# Altium schematic sheet Coolant_Relays.SchDoc: STM32F446 CNC
size B; Author: AM; CompanyName: Expatria Technologies; DrawnBy: A.Marles; Engineer: AM; Organization: Expatria Technolgoies; DocumentNumber: 7; SheetNumber: 7; SheetTotal: 22
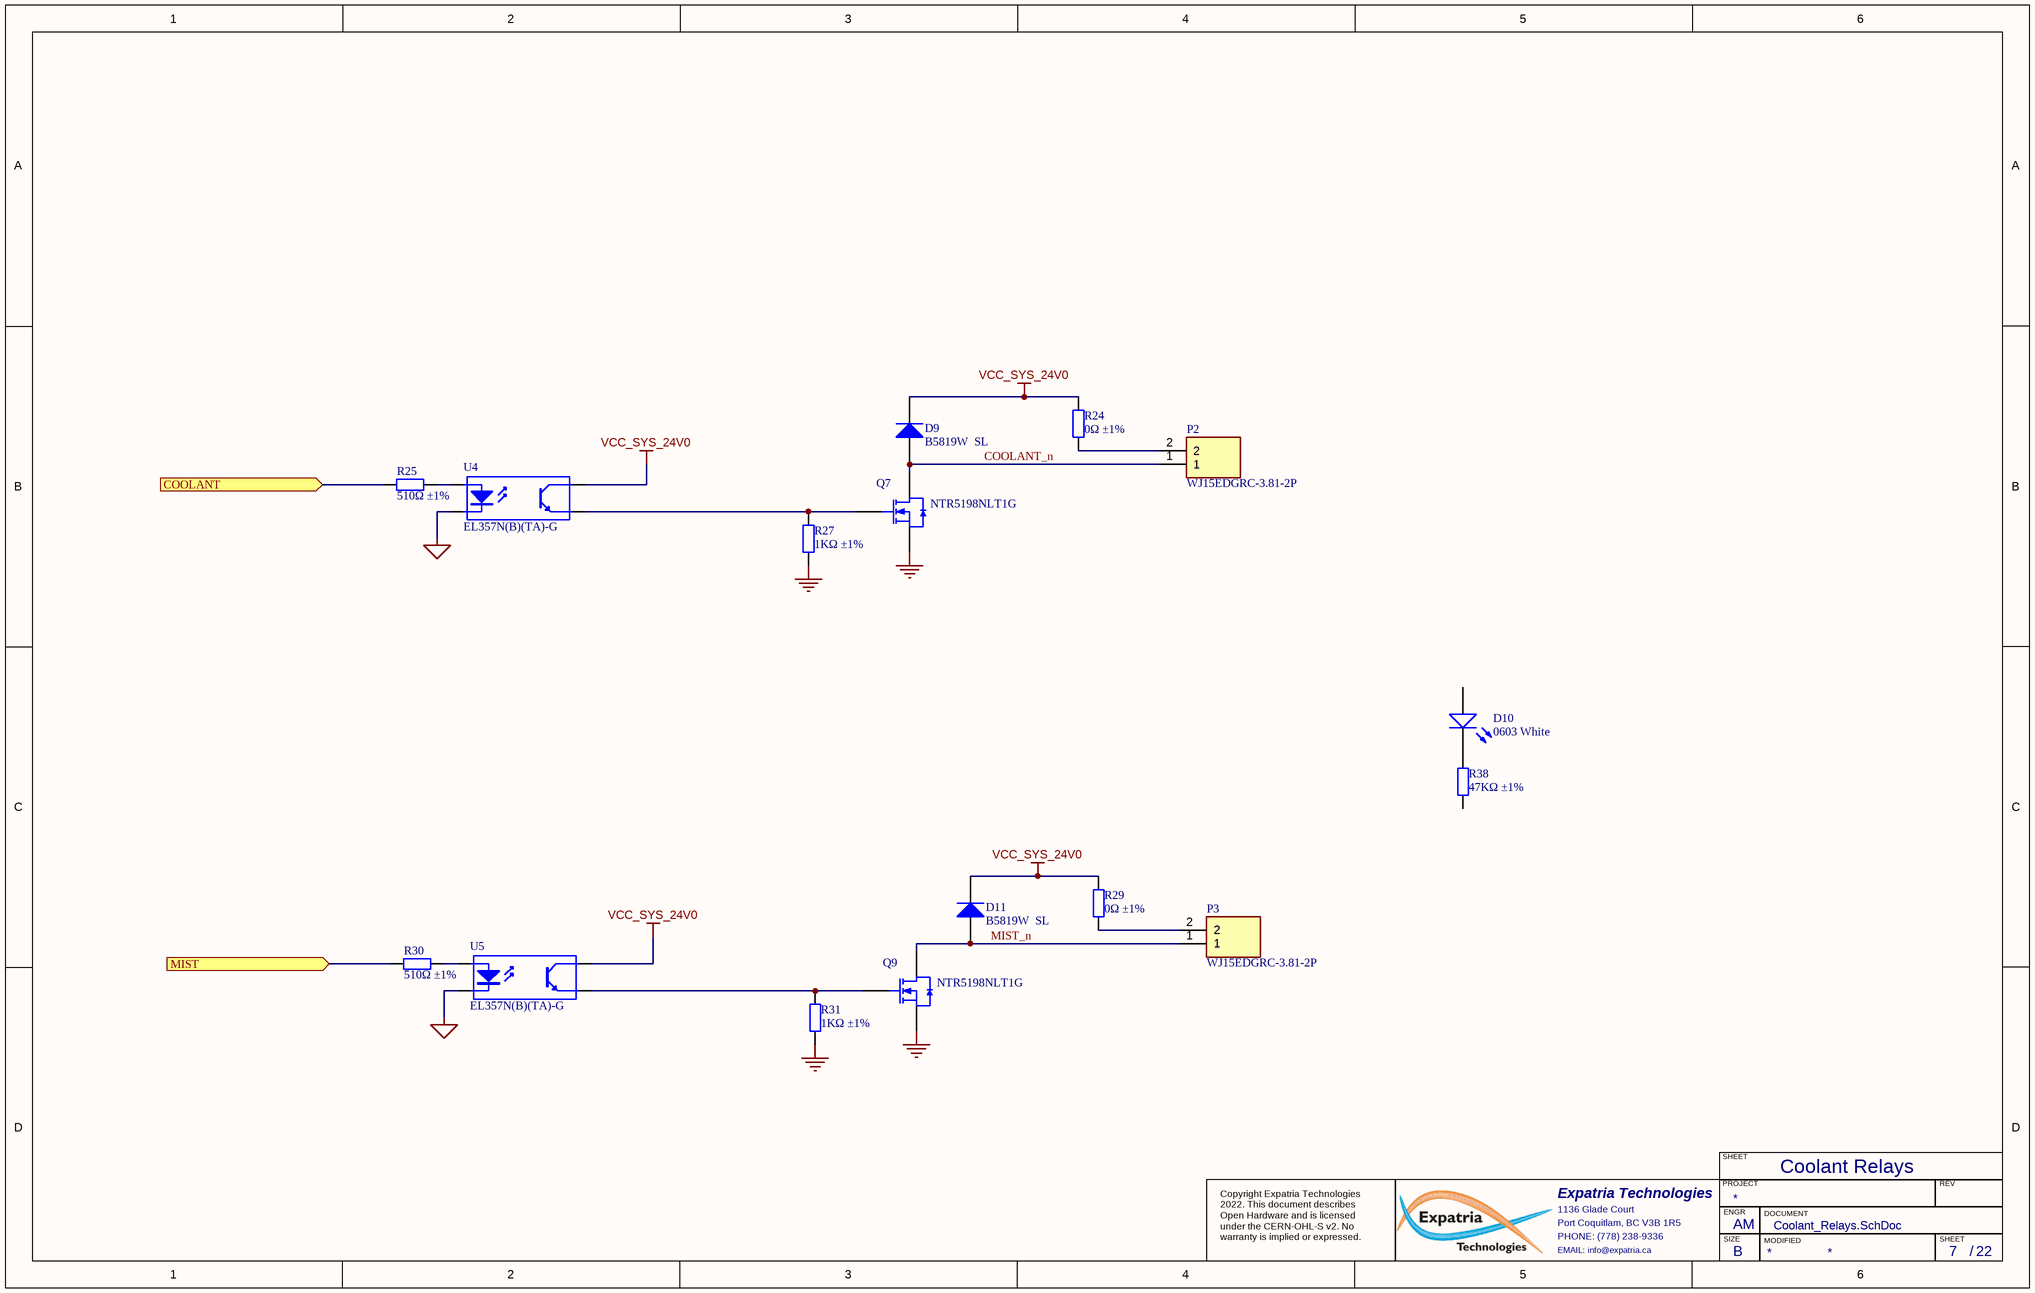
[diagram p0: Coolant_Relays.SchDoc]

## Parts
D9  B5819W  SL  [SOD-123]
D10  0603 White  [0603_LED_S1]
D11  B5819W  SL  [SOD-123]
P2  WJ15EDGRC-3.81-2P  [SHDRRA2W85P0X381_1X2_850X915X720P]
P3  WJ15EDGRC-3.81-2P  [SHDRRA2W85P0X381_1X2_850X915X720P]
Q7  NTR5198NLT1G  [SOT-23-3L]
Q9  NTR5198NLT1G  [SOT-23-3L]
R24  0Ω ±1%  [0603_R]
R25  510Ω ±1%  [0603_R]
R27  1KΩ ±1%  [0603_R]
R29  0Ω ±1%  [0603_R]
R30  510Ω ±1%  [0603_R]
R31  1KΩ ±1%  [0603_R]
R38  47KΩ ±1%  [0603_R]
U4  EL357N(B)(TA)-G  [SOP-4_P2.54]
U5  EL357N(B)(TA)-G  [SOP-4_P2.54]

## Ports
COOLANT (in), MIST (in)

## Nets
GND: Q7.2(S) Q9.2(S) R27.1 R31.1
MCU_GND: U4.2(K) U5.2(K)
VCC_SYS_24V0: D9.2(K) D11.2(K) R24.1 R29.1 U4.4(C) U5.4(C)
COOLANT: R25.1 ; port COOLANT
COOLANT_n: D9.1(A) P2.1 Q7.3(D)
MIST: R30.1 ; port MIST
MIST_n: D11.1(A) P3.1 Q9.3(D)
NetD10_K: D10.K R38.2
NetP2_2: P2.2 R24.2
NetP3_2: P3.2 R29.2
NetQ7_1: Q7.1(G) R27.2 U4.3(E)
NetQ9_1: Q9.1(G) R31.2 U5.3(E)
NetR25_2: R25.2 U4.1(A)
NetR30_2: R30.2 U5.1(A)

Not connected (* = marked no-connect by the designer): D10 A; R38 1

## Notes on the sheet
- Coolant Relays
- SHEET
- Expatria Technologies
- 1136 Glade Court
- Port Coquitlam, BC V3B 1R5
- PHONE: (778) 238-9336
- PROJECT
- SIZE
- ENGR
- MODIFIED
- DOCUMENT
- REV
- Copyright Expatria Technologies 2022. This document describes Open Hardware and is licensed under the CERN-OHL-S v2. No warranty is implied or expressed.
- EMAIL: info@expatria.ca
- B
- /

## Library data of the parts
D9 D11 = SOD-123 B5819W  SL: Schottky Diode; ComponentLink1Description: 供应商链接; ComponentLink1URL: http://www.szlcsc.com/product/details_9093.html; Package: SOD-123; Supplier: LC; SuppliersPartNumber: C8598
D10 = 19-217UWD/S365-2/TR8: LED; Package: 0603; Supplier: LC; SuppliersPartNumber: C133759; Color: White
P2 P3 = WJ15EDGRC-3.81-2P: 3.81mm Green Board Edge/Receptacle-Close Push-Pull,P=3.81mm Pluggable System Terminal Block ROHS; Manufacturer_Name: Ningbo Kangnex; SuppliersPartNumber: C8387; Datasheet Link: https://datasheet.lcsc.com/szlcsc/Ningbo-Kangnex-Elec-WJ15EDGRC-3-81-2P_C8387.pdf; Height: 7.2mm; Manufacturer_Part_Number: WJ15EDGRC-3.81-2P
Q7 Q9 = AO3400A: 60V 1.7A 155mΩ@10V,1A 900mW 2.5V@250uA N Channel SOT-23(SOT-23-3) MOSFETs ROHS; Manufacturer 1: onsemi; ComponentLink1Description: 供应商链接; ComponentLink1URL: http://www.szlcsc.com/product/details_21629.html; Package: SOT-23-3L; Supplier: LC; SuppliersPartNumber: C163243; Supplier 1: LC; Supplier Part Number 1: C163243; Manufacturer Part Number 1: NTR5198NLT1G
R24 R29 = 0603 0R (0R0) 1%: Chip resistor; Manufacturer: Uniroyal Elec; PartNumber: 0603WAF0000T5E; Power: 1/10W; ComponentLink1Description: Supplier link; ComponentLink1URL: http://www.szlcsc.com/product/details_21903.html; Package: 0603; Supplier: LC; SuppliersPartNumber: C21189; Resistance: 0Ω; Tolerance: 1%
R25 R30 = 0603 510R (5100) 1%: Chip resistor; Manufacturer: Uniroyal Elec; PartNumber: 0603WAF5100T5E; Power: 1/10W; ComponentLink1Description: Supplier link; ComponentLink1URL: http://www.szlcsc.com/product/details_23920.html; Package: 0603; Supplier: LC; SuppliersPartNumber: C23193; Resistance: 510Ω; Tolerance: 1%
R27 R31 = 0603 1K (1001) 1%: Chip resistor; Manufacturer: Uniroyal Elec; PartNumber: 0603WAF1001T5E; Power: 1/10W; ComponentLink1Description: Supplier link; ComponentLink1URL: http://www.szlcsc.com/product/details_21904.html; Package: 0603; Supplier: LC; SuppliersPartNumber: C21190; Resistance: 1KΩ; Tolerance: 1%
R38 = 0603 47K (4702) 1%: Chip resistor; Manufacturer: Uniroyal Elec; PartNumber: 0603WAF4702T5E; Power: 1/10W; ComponentLink1Description: Supplier link; ComponentLink1URL: http://www.szlcsc.com/product/details_26562.html; Package: 0603; Supplier: LC; SuppliersPartNumber: C25819; Resistance: 47KΩ; Tolerance: 1%
U4 U5 = EL357N(B)(TA)-G_[C6649]: OPTOISOLATOR 3.75KV TRANS 4-SOP; Manufacturer 1: Everlight Elec; ComponentLink1Description: 供应商链接; ComponentLink1URL: http://www.szlcsc.com/product/details_7114.html; Package: SOP-4_P2.54; Supplier: LC; SuppliersPartNumber: C6649; Manufacturer Part Number 1: EL357N(B)(TA)-G